# EAGLE schematic heater (EAGLE 9.2.0)
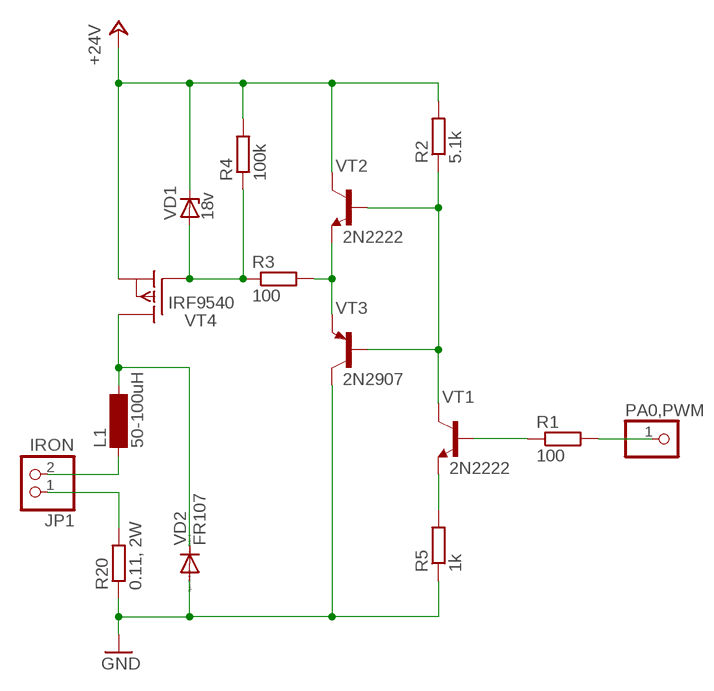
[diagram p0: schematic, sheet 1]

## Parts
JP1  IRON  PINHD-1X2  [1X02]
L1  50-100uH  SD8  [SD8]
PA0,PWM  PINHD-1X1  [1X01]
R1  100  R-EU_0207/10  [0207/10]
R2  5.1k  R-EU_0207/10  [0207/10]
R3  100  R-EU_0207/10  [0207/10]
R4  100k  R-EU_0207/10  [0207/10]
R5  1k  R-EU_0207/10  [0207/10]
R20  0.11, 2W  R-EU_0207/10  [0207/10]
VD1  18v  ZENER-DIODEC1702-15  [C1702-15]
VD2  FR107  1N4004  [DO41-10]
VT1  2N2222  [TO18]
VT2  2N2222  [TO18]
VT3  2N2907  2N2907-PNP-TO18-EBC  [TO18]
VT4  IRF9540  IRF9530  [TO220]

## Nets
+24V: R2.2 R4.2 VD1.C VT2.3(C) VT4.3(S)
GND: R5.1 R20.1 VD2.A VT3.3(C)
N$1: JP1.1 R20.2
N$2: JP1.2 L1.1
N$3: L1.2 VD2.C VT4.2(D)
N$4: R3.1 R4.1 VD1.A VT4.1(G)
N$5: R3.2 VT2.1(E) VT3.1(E)
N$6: R2.1 VT1.3(C) VT2.2(B) VT3.2(B)
N$7: R5.2 VT1.1(E)
N$8: R1.1 VT1.2(B)
N$9: PA0,PWM.1 R1.2

## Library data of the parts
JP1 = pinhead:PINHD-1X2: PIN HEADER
L1 = inductor-neosid:SD8: INDUCTOR nominal inductance; OC_FARNELL: unknown; OC_NEWARK: unknown
PA0,PWM = pinhead:PINHD-1X1: PIN HEADER
R1-R5 R20 = rcl:R-EU_: RESISTOR, European symbol; SPICEPREFIX: R
VD1 = diode:ZENER-DIODE: Z-Diode
VD2 = diode:1N4004: DIODE general purpose rectifier, 1 A
VT1 VT2 = transistor:2N2222: NPN TRANSISTOR
VT3 = transistor:*-PNP-: PNP Transistror
VT4 = transistor-fet:IRF9530: P-Channel Enhancement MOSFET (HEXFET); -100V; -12A; 0,3Ohm